# EAGLE design usbasp-dtoy (EAGLE 5.07)
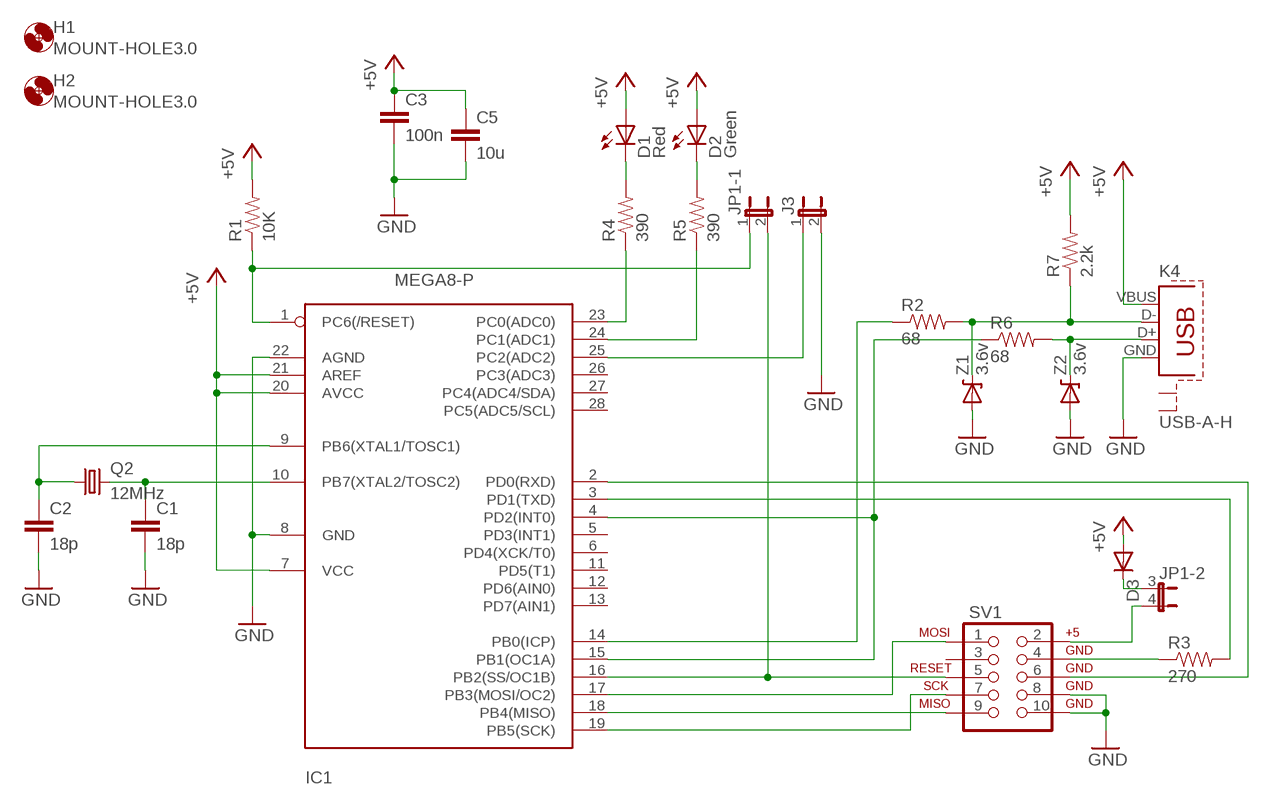
[diagram p0: schematic, sheet 1]

## Parts
C1  18p  C-EUC0805  [C0805]
C2  18p  C-EUC0805  [C0805]
C3  100n  CAPPTH1  [CAP-PTH-5MM]
C5  10u  C-EUC1206K  [C1206K]
D1  Red  LED3MM  [LED3MM]
D2  Green  LED3MM  [LED3MM]
D3  DIODE1N4148  [DIODE-1N4148]
H1  MOUNT-HOLE3.0  [3,0]
H2  MOUNT-HOLE3.0  [3,0]
IC1  MEGA8-P  [DIL28-3]
J3  JP1E  [JP1]
JP1  JP2QE-2X2  [JP2Q]
K4  USB-A-H  [USB-A-H]
Q2  12MHz  CRYTALHC49S  [HC49/S]
R1  10K  RESISTOR1/4W  [AXIAL-0.3]
R2  68  RESISTOR0207/10  [0207/10]
R3  270  RESISTOR1/4W  [AXIAL-0.3]
R4  390  RESISTOR0207/10  [0207/10]
R5  390  RESISTOR0207/10  [0207/10]
R6  68  RESISTOR0207/10  [0207/10]
R7  2.2k  RESISTOR0207/10  [0207/10]
SV1  AVR_SPI_PROG2PTH2  [2X5-SHROUDED]
Z1  3.6v  DIODE-ZENERPTH  [DIODE-ZENER]
Z2  3.6v  DIODE-ZENERPTH  [DIODE-ZENER]

## Nets
+5V: C3.1 C5.1 D1.A D2.A D3.A IC1.7(VCC) IC1.20(AVCC) IC1.21(AREF) K4.VBUS R1.P$2 R7.2
GND: C1.2 C2.2 C3.2 C5.2 IC1.8(GND) IC1.22(AGND) J3.2 K4.GND SV1.8 SV1.10 Z1.P$2(A) Z2.P$2(A)
N$1: K4.D- R2.2 R7.1 Z1.P$1(C)
N$2: K4.D+ R6.2 Z2.P$1(C)
N$3: C1.1 IC1.10(PB7(XTAL2/TOSC2)) Q2.2
N$4: C2.1 IC1.9(PB6(XTAL1/TOSC1)) Q2.1
N$5: JP1.4 SV1.2
N$6: R3.P$1 SV1.4
N$7: IC1.3(PD1(TXD)) R3.P$2
N$8: IC1.2(PD0(RXD)) SV1.6
N$9: IC1.17(PB3(MOSI/OC2)) SV1.1
N$10: IC1.19(PB5(SCK)) SV1.7
N$11: IC1.18(PB4(MISO)) SV1.9
N$12: IC1.16(PB2(SS/OC1B)) JP1.2 SV1.5
N$13: IC1.1(PC6(/RESET)) JP1.1 R1.P$1
N$14: IC1.14(PB0(ICP)) R2.1
N$15: IC1.25(PC2(ADC2)) J3.1
N$16: IC1.23(PC0(ADC0)) R4.1
N$17: IC1.24(PC1(ADC1)) R5.1
N$18: IC1.4(PD2(INT0)) IC1.15(PB1(OC1A)) R6.1
N$19: D1.K(C) R4.2
N$20: D2.K(C) R5.2
N$21: D3.C JP1.3
Unconnected: IC1.5(PD3(INT1)) IC1.6(PD4(XCK/T0)) IC1.11(PD5(T1)) IC1.12(PD6(AIN0)) IC1.13(PD7(AIN1)) IC1.26(PC3(ADC3)) IC1.27(PC4(ADC4/SDA)) IC1.28(PC5(ADC5/SCL)) K4.GND@1(S1) K4.GND@2(S2) SV1.3

## Library data of the parts
C1 C2 C5 = rcl:C-EU: CAPACITOR, European symbol
C3 = digital-toy:CAP: Capacitor Standard 0603 ceramic capacitor, and 0.1" leaded capacitor.
D1 D2 = digital-toy:LED: LEDs Standard schematic elements and footprints for 5mm, 3mm, 1206, and 0603 sized LEDs. 5mm - Spark Fun Electronics SKU : COM-00529 (and others) copy led.lbr 0805 led here, by hyl digital-toy. 2010.6.29
D3 = digital-toy:DIODE: Diode These are standard reverse protection diodes and small signal diodes. SMA package can handle up to about 1A. SOD-323 can handle about 200mA. What the SOD-323 package when ordering, there are some mfgs out there that are 5-pin packages.
H1 H2 = holes:MOUNT-HOLE: MOUNTING HOLE with drill center marker
IC1 = atmel:MEGA8-P: MICROCONTROLLER 8 Kbytes FLASH 1 kbytes SRAM 512 bytes EEPROM USART 4-channel 10 bit ADC 2-channel 8 bit ADC Source: avr.lbr
J3 = jumper:JP1E: JUMPER
JP1 = digital-toy:JP2QE: JUMPER
K4 = digital-toy:USB
Q2 = crystal:CRYTAL: CRYSTAL
R1-R7 = digital-toy:RESISTOR: Resistor Basic schematic elements and footprints for 0603, 1206, and PTH 1/10th watt (small) resistors. digital-toy copy vertical mount of axial-0.3 from rcl.lbr : the 0207/xx
SV1 = digital-toy:AVR_SPI_PROG2: AVR ICSP Header This is the standard AVR In Circuit Serial Programming header. Minimal, but includes pin one indicator. Works with standard Olimex programmers. Also look for the 6-pin reduced version. Spark Fun Electronics SKU: PRT-00778
Z1 Z2 = digital-toy:DIODE-ZENER: Zener Diode Production Part - 8199 3.4V Zener Voltage

## Board
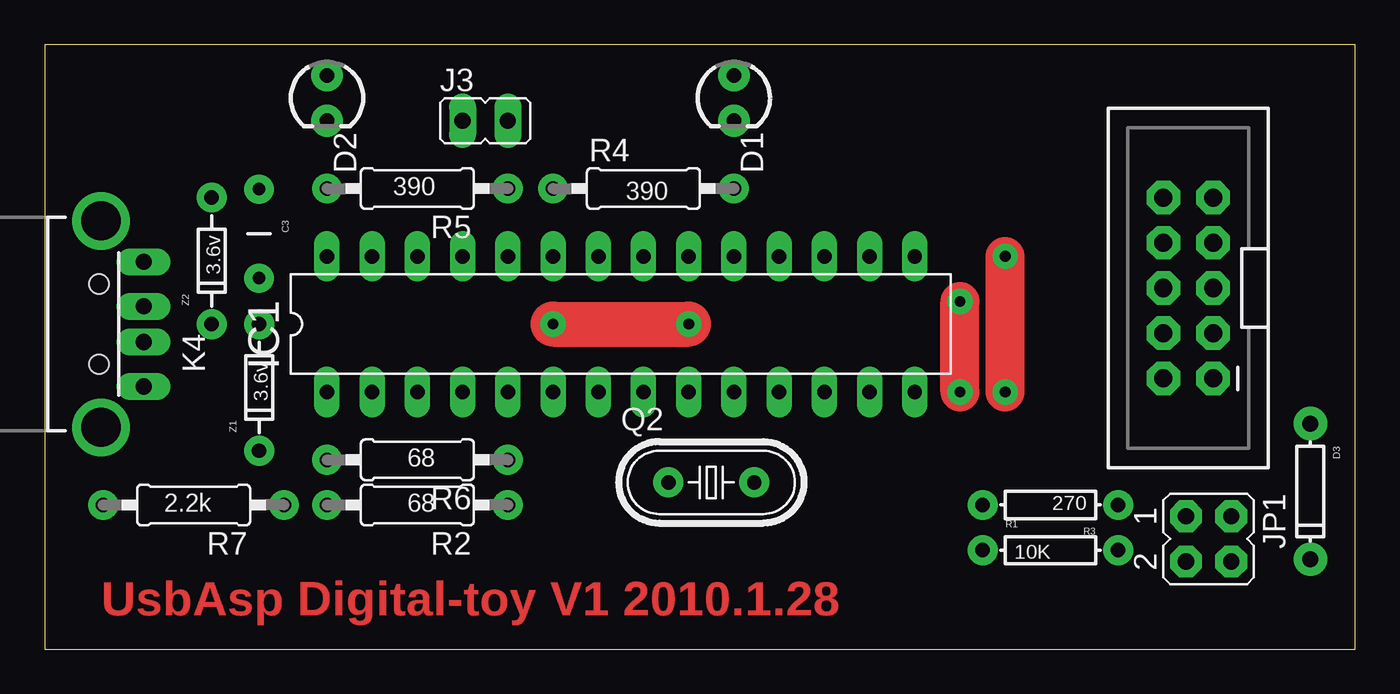
[diagram p1: board, top side]
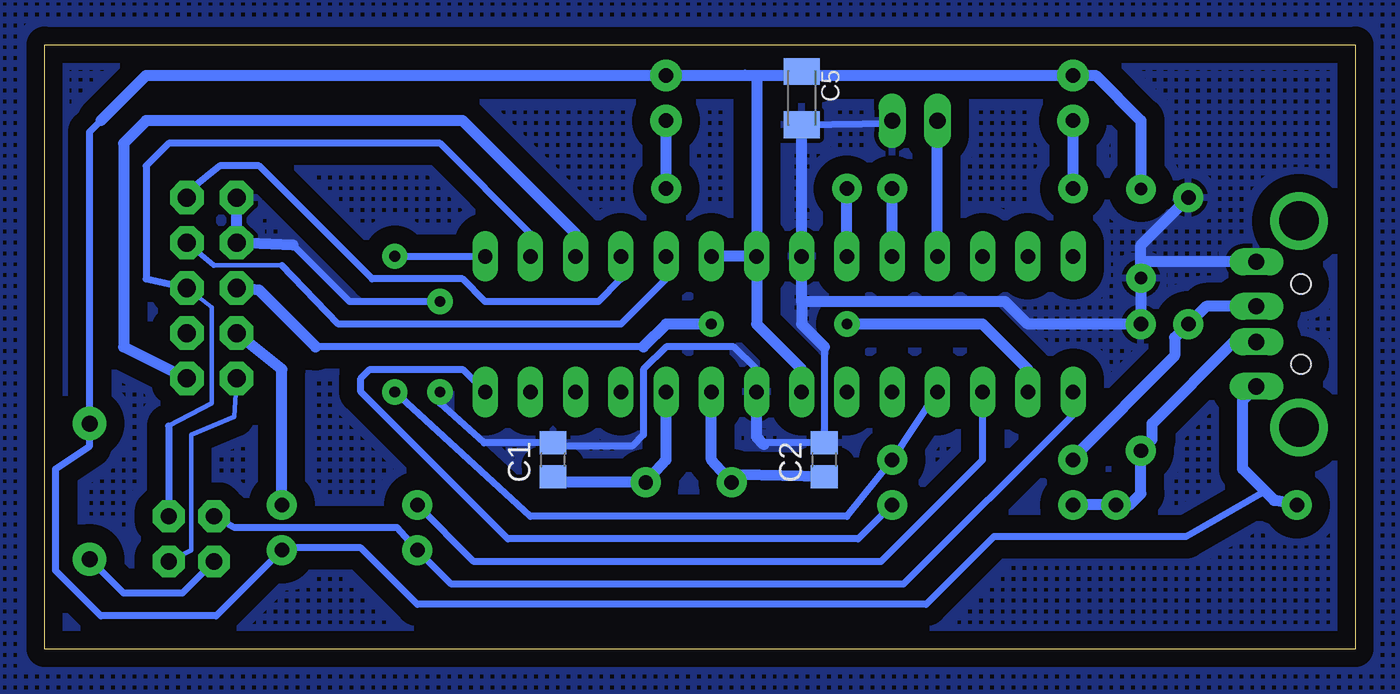
[diagram p2: board, bottom side, seen from below]

Size 73.65 x 33.96 mm. Coordinates in mm from the lower left corner, seen from the top.
Outline: 73.65,0 73.65,33.96 0,33.96 0,0 73.65,0
Copper layers (1*16): Top 0.035mm / dielectric 1.5mm / Bottom 0.035mm
Design rules "SparkFun-HP1007-600x600dpi": minimum track width 10mil, minimum drill 20mil, track to track 8mil, track to pad 8mil, pad to pad 8mil, via to via 8mil, smd to smd 8mil, copper to edge 12mil, drill to drill 12mil, minimum pad ring 12mil, minimum via ring 10mil, stop-mask expansion 4mil, vias tented up to drill 25mil, thermal gap 10mil

### Footprints (pad centres in the part's own frame; a part is rotated, then mirrored left to right if it is on the bottom)
C0805 = smd 1.3 x 1.5: 1 -0.95,0; 2 0.95,0
CAP-PTH-5MM = drill 0.7 pad 1.651 round: 1 -2.5,0; 2 2.5,0
C1206K = smd 1.5 x 2: 1 -1.5,0; 2 1.5,0
LED3MM = drill 0.813 pad 1.778 round: A -1.27,0; K 1.27,0
DIODE-1N4148 = drill 0.9 pad 1.88 round: A -3.81,0; C 3.81,0
3,0 = hole 3: 0,0
DIL28-3 = drill 0.813 long: 1 -16.51,-3.81; 2 -13.97,-3.81; 3 -11.43,-3.81; 4 -8.89,-3.81; 5 -6.35,-3.81; 6 -3.81,-3.81; 7 -1.27,-3.81; 8 1.27,-3.81; 9 3.81,-3.81; 10 6.35,-3.81; 11 8.89,-3.81; 12 11.43,-3.81; 13 13.97,-3.81; 14 16.51,-3.81; 15 16.51,3.81; 16 13.97,3.81; 17 11.43,3.81; 18 8.89,3.81; 19 6.35,3.81; 20 3.81,3.81; 21 1.27,3.81; 22 -1.27,3.81; 23 -3.81,3.81; 24 -6.35,3.81; 25 -8.89,3.81; 26 -11.43,3.81; 27 -13.97,3.81; 28 -16.51,3.81
JP1 = drill 0.914 long: 1 0,-1.27; 2 0,1.27
JP2Q = drill 0.914 pad 1.778 octagon: 1 -1.27,-1.27; 2 -1.27,1.27; 3 1.27,-1.27; 4 1.27,1.27
USB-A-H = drill 0.914 pad 1.422 long: D+ 2.4,1; D- 2.4,-1; GND 2.4,3.5; VBUS 2.4,-3.5 | drill 2.2 round: GND@1 0,5.8; GND@2 0,-5.8 | hole 1.1: -0.1,2.25; -0.1,-2.25
HC49U-V = drill 0.813 pad 1.676 round: 1 -2.413,0; 2 2.413,0
AXIAL-0.3 = drill 0.813 pad 1.676 round: P$1 -3.81,0; P$2 3.81,0
0207/10 = drill 0.813 pad 1.676 round: 1 -5.08,0; 2 5.08,0
2X5-SHROUDED_LOCK = drill 1.016 pad 1.88 octagon: 1 -1.397,5.08; 2 1.397,5.08; 3 -1.397,2.54; 4 1.397,2.54; 5 -1.397,0; 6 1.397,0; 7 -1.397,-2.54; 8 1.397,-2.54; 9 -1.397,-5.08; 10 1.397,-5.08
DIODE-ZENER = drill 0.813 pad 1.676 round: P$1 -3.556,0; P$2 3.556,0

### Placement (x,y rotation side)
C1  45.08,10.63 90 bottom
C2  29.84,10.63 90 bottom
C3  12.06,23.33 270 top
C5  31.11,30.95 270 bottom
D1  38.73,30.95 270 top
D2  15.87,30.95 270 top
D3  71.12,8.85 270 top
H1  -18.42,-8.29 0 top  (outside the outline)
H2  -13.98,43.14 0 top  (outside the outline)
IC1  32.38,18.25 0 top
J3  24.76,29.68 270 top
JP1  65.4,6.18 270 top
K4  3.17,18.25 0 top
Q2  12MHz  [HC49U-V]  37.46,9.36 0 top
R1  56.51,5.55 0 top
R2  20.95,8.09 180 top
R3  56.51,8.09 180 top
R4  33.65,25.87 0 top
R5  20.95,25.87 180 top
R6  20.95,10.63 180 top
R7  8.38,8.09 180 top
SV1  [2X5-SHROUDED_LOCK]  64.26,20.28 180 top
Z1  12.06,14.69 90 top
Z2  9.39,21.81 90 top

### Tracks (layer width: path | path; a pad name or v marks a point on that pad's centre or on a via)
+5V
  Bottom 0.406: 34.28,32.22 34.28,32.35 | D2.A 15.87,32.35 | 31.34,32.22 C5.1 30.88,32.22 | 70.48,29.68 71.12,29.04 D3.A 71.12,11.39 73.02,10.12 73.02,4.41 70.48,1.87 64,1.87 R1.P$2 60.19,5.68 55.88,5.68 52.7,2.5 24.12,2.5 20.32,6.31 9.52,6.31 5.08,8.85
  Bottom 0.61: IC1.7 31.11,15.71 33.65,18.25 IC1.21 | IC1.21 IC1.20 | 33.65,32.22 IC1.21 | 33.65,32.22 34.28,32.22 D1.A 67.94,32.22 70.48,29.68 | 33.65,32.22 31.34,32.22 | 30.88,32.22 D2.A 14.6,32.22 12.06,29.68 C3.1 | R7.2 4.57,8.34 5.08,8.85 6.34,10.12 6.34,13.97 K4.VBUS
GND  (via drill 0.6 pad 1.42)
  Top 2.184: v51.43,14.44 v51.43,19.52
  Bottom 0.406: v51.43,19.52 56.51,19.52 59.68,22.7 | IC1.8 33.65,15.71 34.92,16.98 38.73,16.98 40,15.71 40,12.03 40.63,11.39 44.89,11.39 C1.2 48.96,11.58 51.43,13.8 51.3,14.44 v51.43,14.44 | 29.84,16.98 C2.2 33.23,11.58 33.23,11.48 | C5.2 26.03,29.55 J3.2
  Bottom 0.61: 31.11,19.52 31.11,18.25 29.84,16.98 | 31.11,19.52 IC1.22 C5.2 | 31.11,19.52 19.68,19.52 18.41,18.25 Z1.P$2 C3.2 12.06,21.55 | 59.68,22.7 SV1.8 SV1.10 | 33.23,11.48 33.65,11.9 IC1.8 | 12.06,21.55 12.06,22.7 Z2.P$2 | K4.GND 11.86,21.75 12.06,21.55
  pour Bottom (isolate 1.016, hatched): -18.42,42.51 82.55,42.51 88.9,29.81 88.9,2.5 78.1,-4.48 -6.99,-4.48 -20.96,3.14 -20.96,36.16
N$1
  Bottom 0.61: 15.87,7.84 R2.2 R7.1 12.69,8.09 12.06,8.72 Z1.P$1 11.42,11.77 11.42,12.66 6.84,17.25 K4.D-
N$2
  Bottom 0.61: R6.2 15.87,10.76 10.15,16.47 10.15,17.49 Z2.P$1 8.39,19.25 K4.D+
N$3
  Bottom 0.61: IC1.10 38.73,10.63 Q2.2 44.66,9.36 C1.1
N$4
  Bottom 0.61: IC1.9 36.19,10.63 Q2.1 34.63,9.78 C2.1
N$5
  Bottom 0.254: JP1.4 65.4,5.55 65.4,12.03 62.99,13.04 SV1.2
N$6
  Bottom 0.61: R3.P$1 60.32,15.71 SV1.4
N$7
  Bottom 0.406: IC1.3 20.95,10.63 26.67,4.92 49.52,4.92 R3.P$2
N$8  (via drill 0.6 pad 1.42)
  Top 2.54: v28.57,18.25 v36.19,18.25
  Bottom 0.406: 40,16.98 58.41,16.98
  Bottom 0.61: 40,16.98 38.73,18.25 v36.19,18.25 | IC1.2 18.41,15.71 20.95,18.25 v28.57,18.25 | 58.41,16.98 61.59,20.16 SV1.6
N$9
  Bottom 0.61: IC1.17 43.81,23.33 50.16,29.68 67.94,29.68 69.21,28.41 69.21,16.98 SV1.1
N$10
  Bottom 0.254: 60.32,21.55 64.13,21.55
  Bottom 0.305: 64.13,21.55 SV1.7
  Bottom 0.406: IC1.19 38.73,20.79 41.27,18.25 57.14,18.25 60.32,21.55
N$11
  Bottom 0.406: SV1.9 65.4,25.87 63.81,27.14 61.59,27.14 55.24,20.79 50.16,20.79 48.89,19.52 42.54,19.52 41.27,20.79 IC1.18
N$12
  Bottom 0.254: 66.67,12.54 64.26,13.8 64.26,19.2 SV1.5
  Bottom 0.406: IC1.16 46.35,23.33 51.43,28.41 66.67,28.41 67.94,27.14 67.94,20.79 SV1.5 | 66.67,12.54 JP1.2
N$13
  Bottom 0.406: IC1.1 15.87,13.17 25.39,3.65 50.79,3.65 R1.P$1 53.84,6.82 62.99,6.82 JP1.1
N$14
  Bottom 0.406: IC1.14 50.16,15.71 55.37,15.71 55.88,15.2 55.88,14.44 47.62,6.18 27.94,6.18 R2.1
N$15
  Bottom 0.61: IC1.25 J3.1
N$16
  Bottom 0.61: IC1.23 R4.1
N$17
  Bottom 0.61: IC1.24 R5.1
N$18  (via drill 0.6 pad 1.42)
  Top 2.184: v53.97,14.44 v53.97,22.06
  Bottom 0.406: v53.97,14.44 46.35,7.46 28.57,7.46 R6.1 IC1.4 | v53.97,22.06 IC1.15
N$19
  Bottom 0.61: R4.2 D1.K
N$20
  Bottom 0.61: R5.2 D2.K
N$21
  Bottom 0.406: JP1.3 65.91,3.14 69.21,3.14 D3.C

### Text on the board
Top: UsbAsp Digital-toy V1 2010.1.28